# EAGLE design mouseproxy (EAGLE 8.4.3)
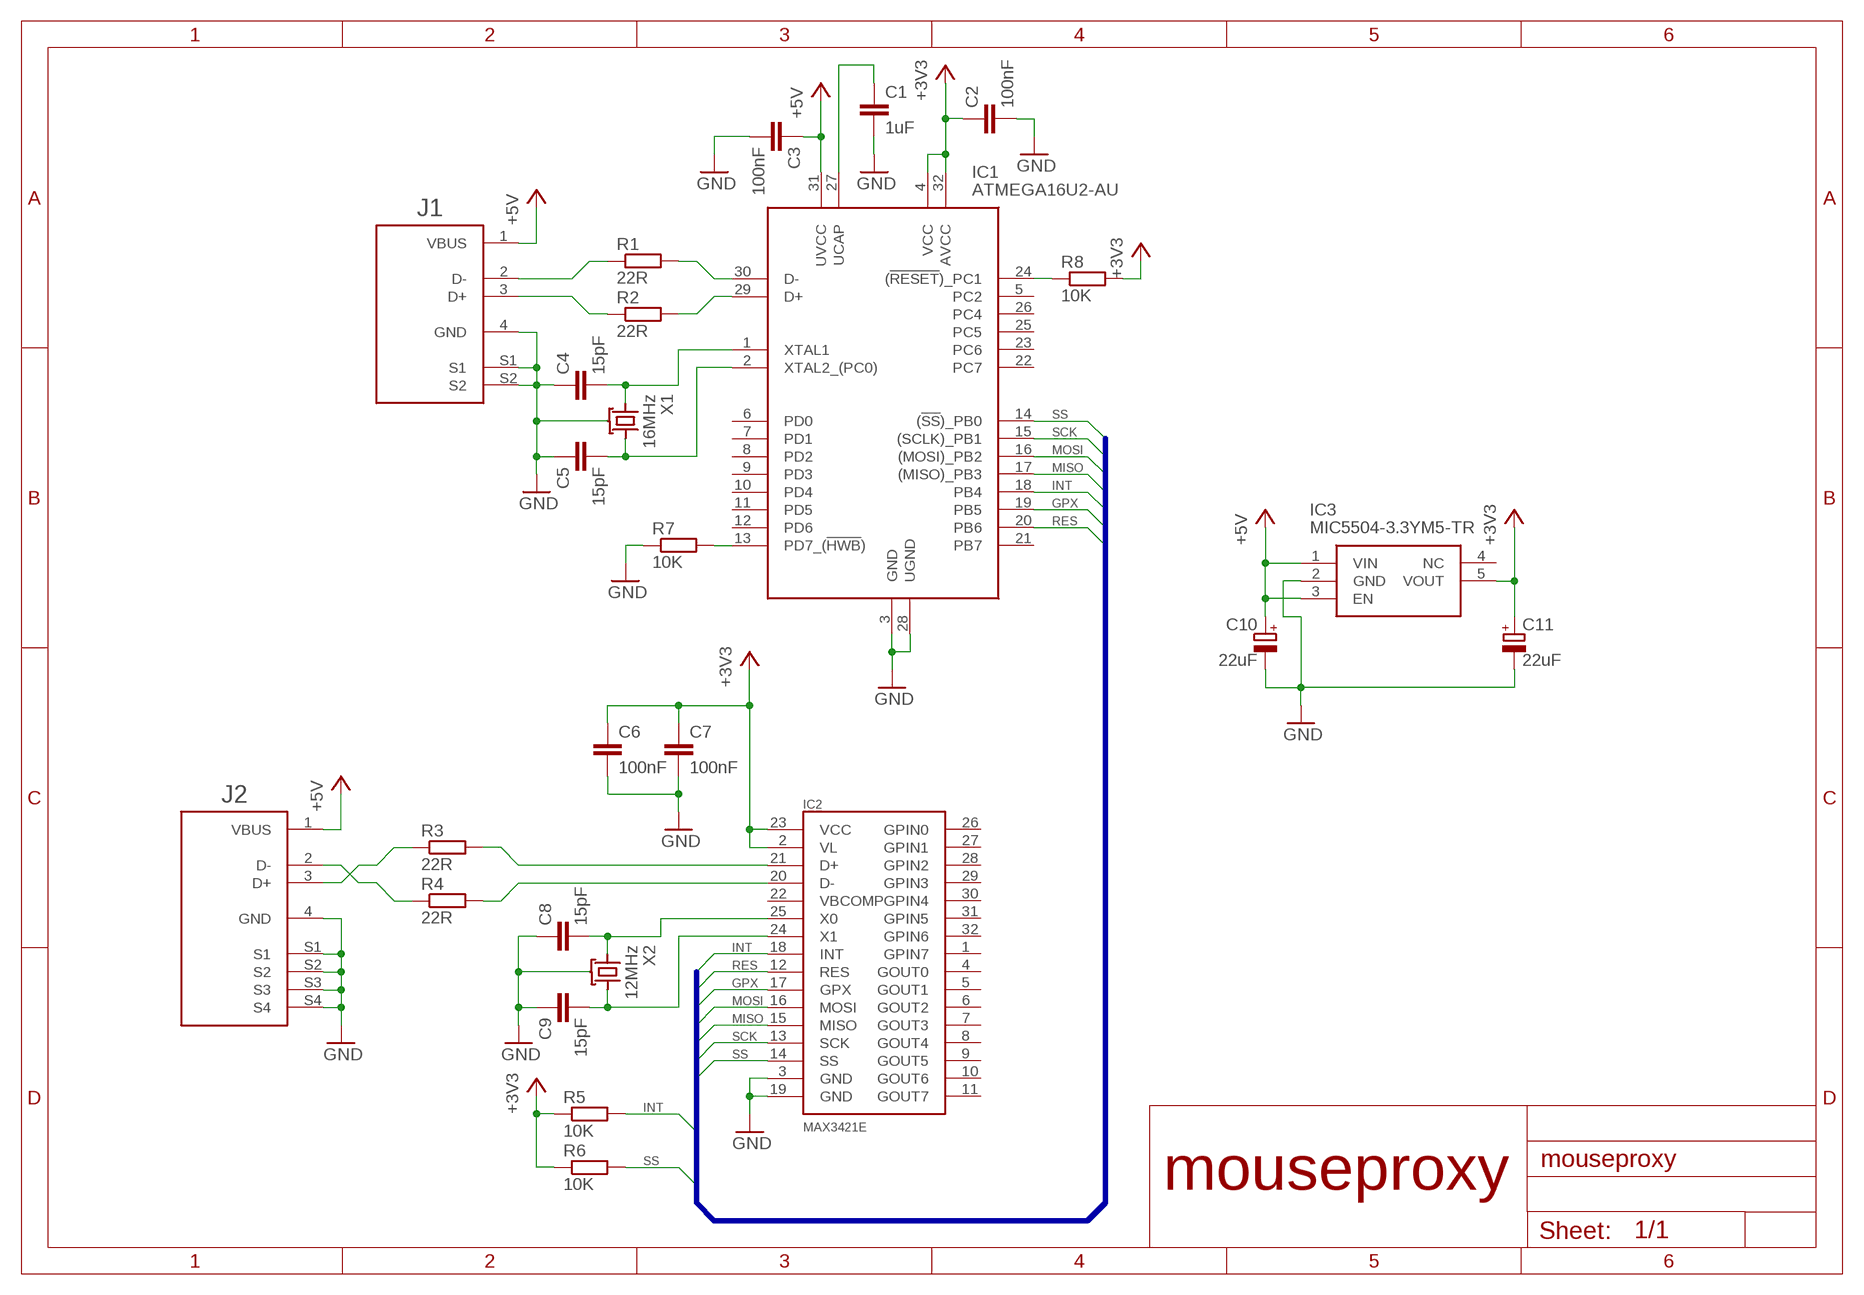
[diagram p0: schematic, sheet 1]
FRAME1 (A4L-LOC): TITLE: main

## Parts
C1  1uF  C0603  [0603]
C2  100nF  C0603  [0603]
C3  100nF  C0603  [0603]
C4  15pF  C0603  [0603]
C5  15pF  C0603  [0603]
C6  100nF  C0603  [0603]
C7  100nF  C0603  [0603]
C8  15pF  C0603  [0603]
C9  15pF  C0603  [0603]
C10  22uF  CPOL1206  [1206POL]
C11  22uF  CPOL1206  [1206POL]
IC1  ATMEGA16U2-AU  [QFP80P900X900X120-32N]
IC2  MAX3421E  [TQFP32-5MM]
IC3  MIC5504-3.3YM5-TR  [SOT95P280X130-5N]
J1  48037-0001  [48037-0001]
J2  48258-0001  [48258-0001]
R1  22R  R0603  [0603]
R2  22R  R0603  [0603]
R3  22R  R0603  [0603]
R4  22R  R0603  [0603]
R5  10K  R0603  [0603]
R6  10K  R0603  [0603]
R7  10K  R0603  [0603]
R8  10K  R0603  [0603]
X1  16MHz  CRYSTAL_SHIELDED3.2X2.5  [3.2X2.5_4]
X2  12MHz  CRYSTAL_SHIELDED3.2X2.5  [3.2X2.5_4]

## Nets
+3V3: C2.1 C6.1 C7.1 C11.1(+) IC1.4(VCC) IC1.32(AVCC) IC2.2(VL) IC2.23(VCC) IC3.5(VOUT) R5.1 R6.1 R8.2
+5V: C3.1 C10.1(+) IC1.31(UVCC) IC3.1(VIN) IC3.3(EN) J1.1(VBUS) J2.1(VBUS)
D_F_N [usb]: IC1.30(D-) R1.2
D_F_P [usb]: IC1.29(D+) R2.2
D_N [usb]: J1.2(D-) R1.1
D_P [usb]: J1.3(D+) R2.1
GND: C1.2 C2.2 C3.2 C4.1 C5.1 C6.2 C7.2 C8.1 C9.1 C10.2(-) C11.2(-) IC1.3(GND) IC1.28(UGND) IC2.3(GND) IC2.19(GND) IC3.2(GND) J1.4(GND) J1.S1 J1.S2 J2.4(GND) J2.S1 J2.S2 J2.S3 J2.S4 R7.1 X1.P$2(GND) X1.P$4(GND) X2.P$2(GND) X2.P$4(GND)
GPX: IC1.19(PB5) IC2.17(GPX)
HOST_D_N [usb]: J2.2(D-) R4.1
HOST_D_P [usb]: J2.3(D+) R3.1
HOST_F_D_N [usb_narrow]: IC2.20(D-) R4.2
HOST_F_D_P [usb_narrow]: IC2.21(D+) R3.2
INT: IC1.18(PB4) IC2.18(INT) R5.2
MISO: IC1.17((MISO)_PB3) IC2.15(MISO)
MOSI: IC1.16((MOSI)_PB2) IC2.16(MOSI)
N$1: C5.2 IC1.2(XTAL2_(PC0)) X1.P$3(XT2)
N$2: C4.2 IC1.1(XTAL1) X1.P$1(XT1)
N$3: C1.1 IC1.27(UCAP)
N$5: C9.2 IC2.24(X1) X2.P$3(XT2)
N$6: C8.2 IC2.25(X0) X2.P$1(XT1)
N$7: IC1.13(PD7_(!HWB!)) R7.2
N$8: IC1.24((!RESET!)_PC1) R8.1
RES: IC1.20(PB6) IC2.12(RES)
SCK: IC1.15((SCLK)_PB1) IC2.13(SCK)
SS: IC1.14((!SS!)_PB0) IC2.14(SS) R6.2
Unconnected: IC1.5(PC2) IC1.6(PD0) IC1.7(PD1) IC1.8(PD2) IC1.9(PD3) IC1.10(PD4) IC1.11(PD5) IC1.12(PD6) IC1.21(PB7) IC1.22(PC7) IC1.23(PC6) IC1.25(PC5) IC1.26(PC4) IC2.1(GPIN7) IC2.4(GOUT0) IC2.5(GOUT1) IC2.6(GOUT2) IC2.7(GOUT3) IC2.8(GOUT4) IC2.9(GOUT5) IC2.10(GOUT6) IC2.11(GOUT7) IC2.22(VBCOMP) IC2.26(GPIN0) IC2.27(GPIN1) IC2.28(GPIN2) IC2.29(GPIN3) IC2.30(GPIN4) IC2.31(GPIN5) IC2.32(GPIN6) IC3.4(NC)

## Buses
INT,RES,GPX,MOSI,MISO,SCK,SS

## Notes on the sheet
- mouseproxy

## Library data of the parts
C1-C9 = jpercl:C
C10 C11 = jpercl:CPOL
IC1 = ATMEGA16U2-AU:ATMEGA16U2-AU: ATMEGA16U2-AU, 8 bit AVR Microcontroller 16MHz 16 kB, 512 B Flash, 512 B RAM, USB 32-Pin TQFP Source: Datasheet <http://www.atmel.com/images/doc7799.pdf>; DESCRIPTION: ATMEGA16U2-AU, 8 bit AVR Microcontroller 16MHz 16 kB, 512 B Flash, 512 B RAM, USB 32-Pin TQFP; HEIGHT: 1.2mm; MANUFACTURER_NAME: Microchip; MANUFACTURER_PART_NUMBER: ATMEGA16U2-AU; MOUSER_PART_NUMBER: 556-ATMEGA16U2-AU; MOUSER_PRICE-STOCK: https://www.mouser.com/Search/Refine.aspx?Keyword=556-ATMEGA16U2-AU; RS_PART_NUMBER: 1278282P; RS_PRICE-STOCK: http://uk.rs-online.com/web/p/products/1278282P
IC2 = MAX3421E:MAX3421E: USB Peripheral/Host Controller with SPI Interface.; AVAILABILITY: Unavailable; DESCRIPTION: USB Controller USB 2.0 SPI Interface 32-TQFN-EP _5x5_; MF: Maxim Integrated; MP: MAX3421E; PACKAGE: TQFP-32 Maxim Integrated; PRICE: None
IC3 = MIC5504-3.3YM5-TR:MIC5504-3.3YM5-TR: LDO Voltage Regulators Single 300mA LDO Source: Datasheet <http://docs-emea.rs-online.com/webdocs/141e/0900766b8141ed4f.pdf>; DESCRIPTION: LDO Voltage Regulators Single 300mA LDO; HEIGHT: 1.3mm; MANUFACTURER_NAME: Microchip; MANUFACTURER_PART_NUMBER: MIC5504-3.3YM5-TR; MOUSER_PART_NUMBER: 998-MIC5504-3.3YM5TR; MOUSER_PRICE-STOCK: https://www.mouser.com/Search/Refine.aspx?Keyword=998-MIC5504-3.3YM5TR; RS_PART_NUMBER: 9113332P; RS_PRICE-STOCK: http://uk.rs-online.com/web/p/products/9113332P
J1 = 48037-0001:48037-0001
J2 = 48258-0001:48258-0001
R1-R8 = jpercl:R
X1 X2 = jpercl:CRYSTAL_SHIELDED

## Net classes
1 usb: width 0.471 mm
2 usb_narrow: width 0.254 mm

## Board
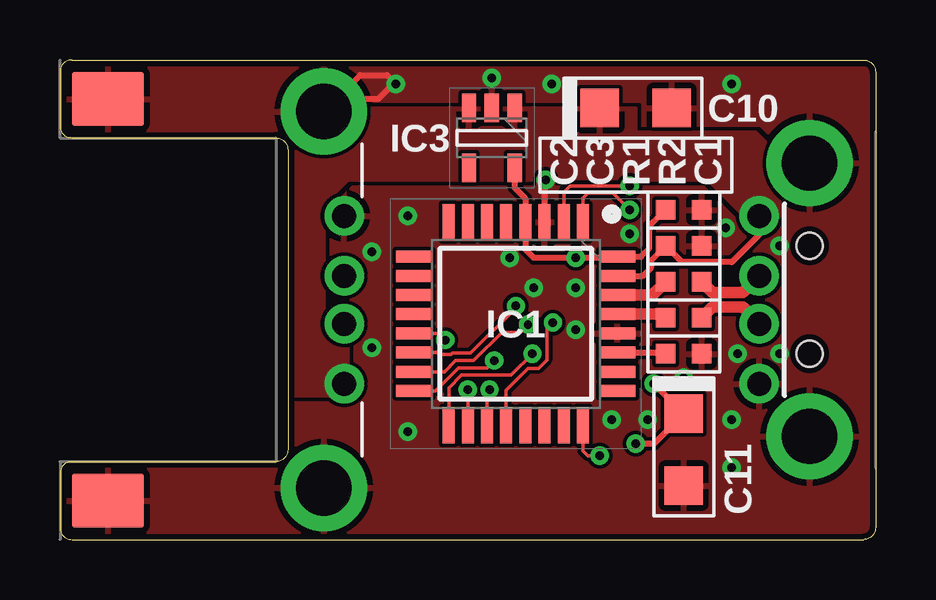
[diagram p1: board, top side]
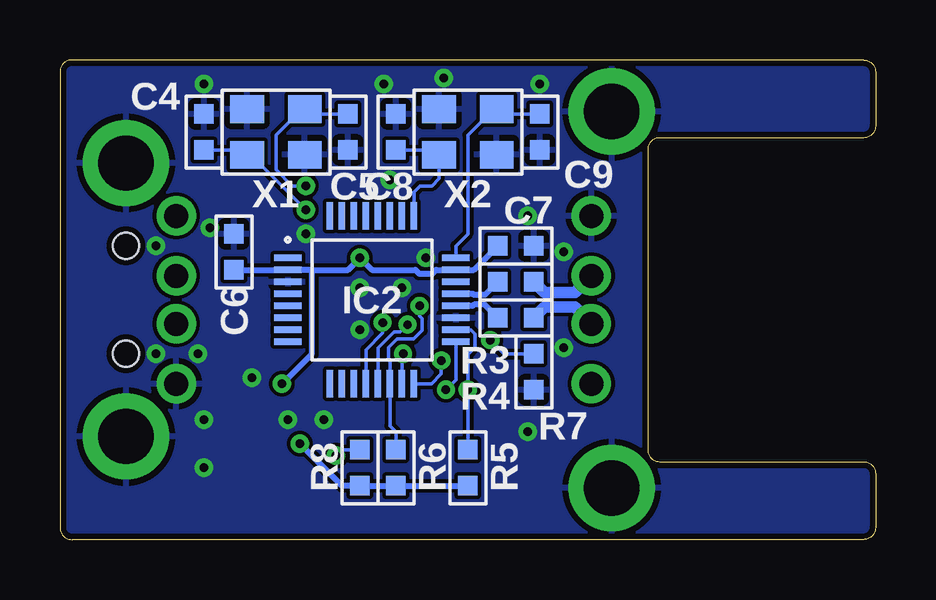
[diagram p2: board, bottom side, seen from below]

Size 34 x 20 mm. Coordinates in mm from the lower left corner, seen from the top.
Outline: 0.5,20 33.5,20 arc-90 34,19.5 34,0.5 arc-90 33.5,0 0.5,0 arc-90 0,0.5 0,2.75 arc-90 0.5,3.25 9,3.25 arc90 9.5,3.75 9.5,16.25 arc90 9,16.75 0.5,16.75 arc-90 0,17.25 0,19.5 arc-90 0.5,20
Copper layers (1*16): Top 0.035mm / dielectric 1.5mm / Bottom 0.035mm
Design rules "default *": minimum track width 6mil, minimum drill 0.35mm, track to track 6mil, track to pad 6mil, pad to pad 6mil, via to via 6mil, smd to smd 6mil, copper to edge 0.25mm, drill to drill 6mil, minimum pad ring 10mil, minimum via ring 8mil, stop-mask expansion 4mil, vias tented up to drill 0.4mm, thermal gap 10mil

### Footprints (pad centres in the part's own frame; a part is rotated, then mirrored left to right if it is on the bottom)
0603 = smd 0.8 x 0.8: 1 -0.75,0; 2 0.75,0
1206POL = smd 1.6 x 1.6: 1 -1.5,0; 2 1.5,0
QFP80P900X900X120-32N = smd 1.5 x 0.5: 1 -4.238,2.8; 2 -4.238,2; 3 -4.238,1.2; 4 -4.238,0.4; 5 -4.238,-0.4; 6 -4.238,-1.2; 7 -4.238,-2; 8 -4.238,-2.8; 17 4.238,-2.8; 18 4.238,-2; 19 4.238,-1.2; 20 4.238,-0.4; 21 4.238,0.4; 22 4.238,1.2; 23 4.238,2; 24 4.238,2.8 | smd 0.5 x 1.5: 9 -2.8,-4.238; 10 -2,-4.238; 11 -1.2,-4.238; 12 -0.4,-4.238; 13 0.4,-4.238; 14 1.2,-4.238; 15 2,-4.238; 16 2.8,-4.238; 25 2.8,4.238; 26 2,4.238; 27 1.2,4.238; 28 0.4,4.238; 29 -0.4,4.238; 30 -1.2,4.238; 31 -2,4.238; 32 -2.8,4.238
TQFP32-5MM = smd 1.143 x 0.254: 1 -3.5,1.75; 2 -3.5,1.25; 3 -3.5,0.75; 4 -3.5,0.25; 5 -3.5,-0.25; 6 -3.5,-0.75; 7 -3.5,-1.25; 8 -3.5,-1.75; 17 3.5,-1.75; 18 3.5,-1.25; 19 3.5,-0.75; 20 3.5,-0.25; 21 3.5,0.25; 22 3.5,0.75; 23 3.5,1.25; 24 3.5,1.75 | smd 0.254 x 1.143: 9 -1.75,-3.5; 10 -1.25,-3.5; 11 -0.75,-3.5; 12 -0.25,-3.5; 13 0.25,-3.5; 14 0.75,-3.5; 15 1.25,-3.5; 16 1.75,-3.5; 25 1.75,3.5; 26 1.25,3.5; 27 0.75,3.5; 28 0.25,3.5; 29 -0.25,3.5; 30 -0.75,3.5; 31 -1.25,3.5; 32 -1.75,3.5
SOT95P280X130-5N = smd 1.2 x 0.6: 1 -1.25,0.95; 2 -1.25,0; 3 -1.25,-0.95; 4 1.25,-0.95; 5 1.25,0.95
48037-0001 = drill 1 pad 1.65: 1 3.5,4.85; 2 1,4.85; 3 -1,4.85; 4 -3.5,4.85 | drill 2.3 pad 3.6: S1 5.7,2.75; S2 -5.7,2.75 | hole 1.1: -2.25,2.75; 2.25,2.75
48258-0001 = drill 1 pad 1.65: 1 3.5,11.85; 2 1,11.85; 3 -1,11.85; 4 -3.5,11.85 | drill 2.3 pad 3.6: S1 7.85,11; S2 -7.85,11 | smd 2.25 x 3: S3 8.375,2; S4 -8.375,2
3.2X2.5_4 = smd 1.4 x 1.15: P$1 -1.2,-0.95; P$2 1.2,-0.95; P$3 1.2,0.95; P$4 -1.2,0.95

### Placement (x,y rotation side)
C1  26,7.75 0 top
C2  26,13.75 0 top
C3  26,12.25 0 top
C4  28,17 270 bottom
C5  22,17 90 bottom
C6  26.75,12 90 bottom
C7  15,12.25 0 bottom
C8  20,17 270 bottom
C9  14,17 90 bottom
C10  24,18 0 top
C11  26,3.75 270 top
IC1  19,9 270 top
IC2  21,10 0 bottom
IC3  18,16.75 270 top
J1  34,10 90 top
J2  0,10 270 top
R1  26,10.75 180 top
R2  26,9.25 180 top
R3  15,10.75 180 bottom
R4  15,9.25 180 bottom
R5  17,3 90 bottom
R6  20,3 90 bottom
R7  14.25,7 90 bottom
R8  21.5,3 270 bottom
X1  25,17 0 bottom
X2  17,17 0 bottom

### Tracks (layer width: path | path; a pad name or v marks a point on that pad's centre or on a via)
+3V3  (via drill 0.35)
  Top 0.254: C2.1 24.57,13.07 24.57,12.14 24.23,11.8 IC1.32 23.19,11.75 v21.5,11.75 19.75,11.75 19.4,12.1 IC1.4 19.4,14.22 18.95,14.68 IC3.5 | v24.75,6.5 C11.1 24.75,4 v24,4
  Bottom 0.254: 23.5,11.25 IC2.2 C6.1 | 23.5,11.25 22,11.25 v21.5,11.75 21,11.25 19.18,11.25 19.02,11.09 18.48,11.09 18.32,11.25 IC2.23 16.75,11.25 C7.1 | v24.75,6.5 23.5,7.75 23.5,11.25 | R5.1 R6.1 R8.2 22.25,2.25 v24,4
+5V
  Top 0.254: IC1.31 24.3,11 24.65,11.35 24.65,11.65 C3.1 25.93,11.57 28,11.57 29.15,12.72 J1.1
  pour Top (rank 2): 12,6 12,8 11,9 11,14 12,15 19.75,15 19.75,15.25 20.75,15.25 20.75,15 27,15 29,13 29.5,13 30,13.5 30,16 29,17 24,17 24,18 11,18 9,16 9,6
  pour Top (no thermals): 28,14 29,13 29.5,13 30,13.5 30,14.5 29,15.5 27.75,14.25
  pour Top (no thermals): 10,8 12,8 12,6 10,6
D_F_N
  Top 0.471: R1.2 24.7,10.2 IC1.30
D_F_P
  Top 0.471: R2.2 25.1,9.4 IC1.29
D_N
  Top 0.471: R1.1 27.19,10.31 28.46,10.31 J1.2
D_P
  Top 0.471: R2.1 27.19,9.69 28.46,9.69 J1.3
GND  (via drill 0.35)
  Top 0.254: v20.25,15 20.2,14.95 IC1.3 | 11.95,18.8 J2.S2 | 11.95,18.8 12.53,19.38 13.62,19.38 v14,19 13.88,19 13.25,18.38 12.38,18.38 11.95,18.8
  other vias: 18.75,11.75 19.75,10.5 21.5,10.5 21.5,8.75 23,5 24.5,5 26,6.75 14.5,13.5 20.5,19 28,19 23.75,12.75 27.75,13 18,19.25 28.25,7.75 28,5 28,3 14.5,4.5 13,8 13,12 30,7.75 30,12.25
  pour Bottom (rank 3): 0,20 34,20 34,0 0,0
  pour Top (rank 3): 0,20 34,20 34,0 0,0
GPX  (via drill 0.35)
  Top 0.152: IC1.19 17.8,6.14 v17.91,6.25
  Bottom 0.152: v17.91,6.25 17.5,6.66 IC2.17
HOST_D_N
  Bottom 0.471: J2.2 12.54,9.69 13.81,9.69 R4.1
HOST_D_P
  Bottom 0.471: J2.3 12.54,10.31 13.81,10.31 R3.1
HOST_F_D_N
  Bottom 0.254: R4.2 16.3,9.8 16.75,9.8 16.8,9.75 IC2.20
HOST_F_D_P
  Bottom 0.254: R3.2 16.3,10.2 16.75,10.2 16.8,10.25 IC2.21
INT  (via drill 0.35)
  Top 0.152: IC1.18 v17,6.25
  Bottom 0.152: R5.2 v17,6.25 17,7.73 16.7,8.03 16.7,8.57 16.88,8.75 IC2.18
MISO  (via drill 0.35)
  Top 0.152: v19.7,7.75 18.8,6.86 16.75,6.86 16.22,6.33 16.22,4.78 IC1.17
  Bottom 0.152: IC2.15 19.75,7.7 v19.7,7.75
MOSI  (via drill 0.35)
  Top 0.152: v18.11,7.46 17.8,7.16 16.62,7.16 15.66,6.2 IC1.16
  Bottom 0.152: IC2.16 18.52,6.5 18.11,6.91 v18.11,7.46
N$1  (via drill 0.35)
  Top 0.152: IC1.2 21,14.5 21.25,14.75 v23.75,14.75
  Bottom 0.152: C5.2 23.6,17.75 X1.P$3 23.93,17.95 25,16.88 25,15.43 24.32,14.75 v23.75,14.75
N$2  (via drill 0.35)
  Top 0.152: IC1.1 21.8,14.25 22,14.45 23.05,14.45 v23.75,13.75
  Bottom 0.152: C4.2 26.4,16.25 X1.P$1 26.05,16.05 v23.75,13.75
N$3
  Top 0.254: IC1.27 25.2,7.8 C1.1
N$5
  Bottom 0.152: C9.2 15.6,17.75 X2.P$3 15.93,17.95 17,16.88 17,12.75 17.5,12.25 IC2.24
N$6
  Bottom 0.152: C8.2 18.4,16.25 X2.P$1 18.2,15.05 18.5,14.75 19,14.75 19.25,14.5 IC2.25
N$7  (via drill 0.35)
  Top 0.152: IC1.13 15.78,8.6 v16.06,8.32
  Bottom 0.152: v16.06,8.32 15.49,7.75 R7.2
N$8  (via drill 0.35)
  Top 0.152: v22.5,3.5 22,3.5 21.8,3.7 IC1.24
  Bottom 0.152: v22.5,3.5 22.25,3.75 R8.1
RES  (via drill 0.35)
  Top 0.152: IC1.20 18.6,6.22 19.52,7.14 19.95,7.14 20.3,7.5 20.3,8.8 v20.55,9.05
  Bottom 0.152: v20.55,9.05 20.55,8.62 21.25,7.92 IC2.12
SCK  (via drill 0.35)
  Top 0.152: v19.51,8.96 19.19,8.64 18.43,8.64 17.25,7.47 16.5,7.47 16.03,7 IC1.15
  Bottom 0.152: v19.51,8.96 19.81,8.66 20.07,8.66 20.75,7.98 IC2.13
SS  (via drill 0.35)
  Top 0.152: v19.01,9.74 19.01,9.65 17.12,7.77 16.37,7.77 16.31,7.71 15.81,7.71 15.72,7.8 IC1.14
  Bottom 0.152: R6.2 20,4.5 20.25,4.75 IC2.14 20.25,7.45 20.3,7.5 20.3,8 19.95,8.36 19.26,8.36 18.9,8.71 18.9,9.21 19.01,9.32 v19.01,9.74